# EAGLE design motorthing-v2 (EAGLE 7.5.0)
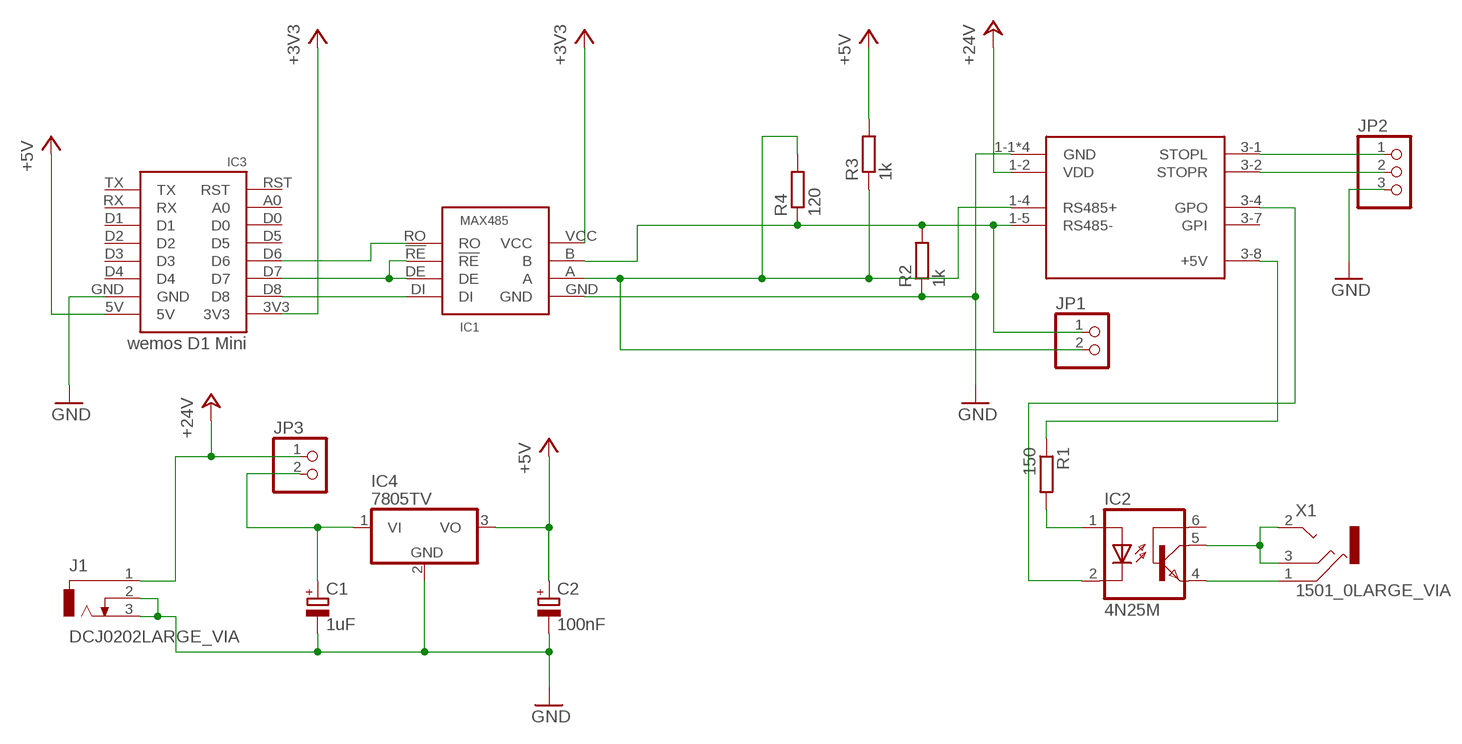
[diagram p0: schematic, sheet 1]

## Parts
C1  1uF  CPOL-EUTT2D6  [TT2D6]
C2  100nF  CPOL-EUTT2D5  [TT2D5]
IC1  MAX485  [DIL08]
IC2  4N25M  [DIL06]
IC3  wemos D1 Mini  WEMOSNOSILK  [WEMOS-NOSILK]
IC4  7805TV  [TO220V]
J1  DCJ0202LARGE_VIA  [DCJ0202_LV]
JP1  PINHD-1X2  [1X02]
JP2  PINHD-1X3  [1X03]
JP3  PINHD-1X2  [1X02]
R1  150  R-EU_0207/10  [0207/10]
R2  1k  R-EU_0207/10  [0207/10]
R3  1k  R-EU_0207/10  [0207/10]
R4  120  R-EU_0207/10  [0207/10]
TMCM-110  TMCM-110  [TMCM-110]
X1  1501_0LARGE_VIA  [1501_05_LV]

## Nets
+3V3: IC1.VCC IC3.3V3
+5V [high_voltage]: C2.+ IC3.5V IC4.3(VO) R3.2
+24V [high_voltage]: J1.1 JP3.1 TMCM-110.1-2(VDD)
GND: C1.- C2.- IC1.GND IC3.GND IC4.2(GND) J1.2 J1.3 JP2.3 R2.1 TMCM-110.1-1(GND) TMCM-110.1-3(GND) TMCM-110.3-3(GND) TMCM-110.3-6(GND)
N$1: IC2.1(A) R1.2
N$2: IC2.4(EMI) X1.1
N$3: IC1.RO IC3.D6
N$4: IC1.DI IC3.D8
N$5: IC1.B JP1.1 R2.2 R4.1 TMCM-110.1-5(RS485-)
N$6: IC2.5(COL) X1.2 X1.3
N$7: R1.1 TMCM-110.3-8(+5V)
N$8: IC2.2(C) TMCM-110.3-4(GPO)
N$9: JP2.1 TMCM-110.3-1(STOPL)
N$10: IC1.!RE IC1.DE IC3.D7
N$11: IC1.A JP1.2 R3.1 R4.2 TMCM-110.1-4(RS485+)
N$12: JP2.2 TMCM-110.3-2(STOPR)
N$13 [high_voltage]: C1.+ IC4.1(VI) JP3.2
Unconnected: IC2.6(BAS) IC3.A0 IC3.D0 IC3.D1 IC3.D2 IC3.D3 IC3.D4 IC3.D5 IC3.RST IC3.RX IC3.TX TMCM-110.3-7(GPI)

## Library data of the parts
C1 C2 = rcl:CPOL-EU: POLARIZED CAPACITOR, European symbol
IC1 = max348x:MAX485
IC2 = optocoupler:4N*?M: General Purpose 6-Pin Phototransistor Optocouplers Source: http://www.fairchildsemi.com/ds/4N/4N35-M.pdf; MPN: 4N25-M; OC_FARNELL: 1021349; OC_NEWARK: 98K9084
IC3 = wemos:WEMOS
IC4 = linear:78*: Positive VOLTAGE REGULATOR Source: http://cache.national.com/ds/LM/LM78L05.pdf http://www.fairchildsemi.com/ds/LM/LM7805.pdf
J1 = myparts:DCJ0202: DC POWER JACK Source: DCJ0202.pdf
JP1 JP3 = pinhead:PINHD-1X2: PIN HEADER
JP2 = pinhead:PINHD-1X3: PIN HEADER
R1-R4 = rcl:R-EU_: RESISTOR, European symbol
TMCM-110 = TMCM:TMCM-110
X1 = myparts:1501_0*: Jack connectors according to JISC 6560, 2.5 mm Klinkensteckverbinder nach JISC 6560, 2,5 mm Source: http://www.lumberg.com/Produkte/PDFs/1501_05.pdfedit 1501_03 http://www.lumberg.com/Produkte/PDFs/1501_06.pdf

## Net classes
0 default: clearance 0.205 mm
1 high_voltage: width 1.016 mm, clearance 0.205 mm to class 0, clearance 0.254 mm

## Board
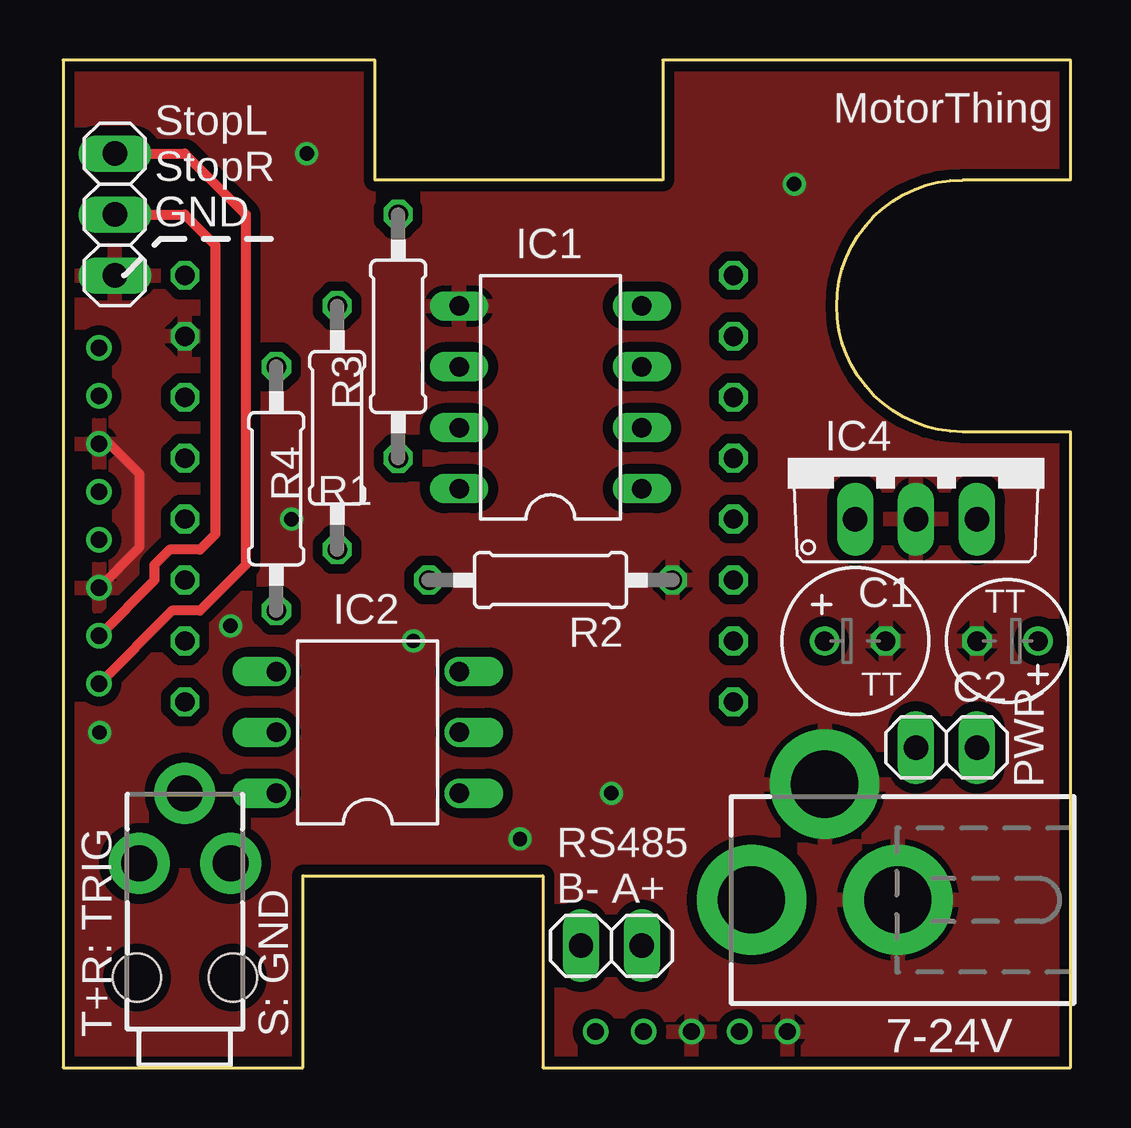
[diagram p1: board, top side]
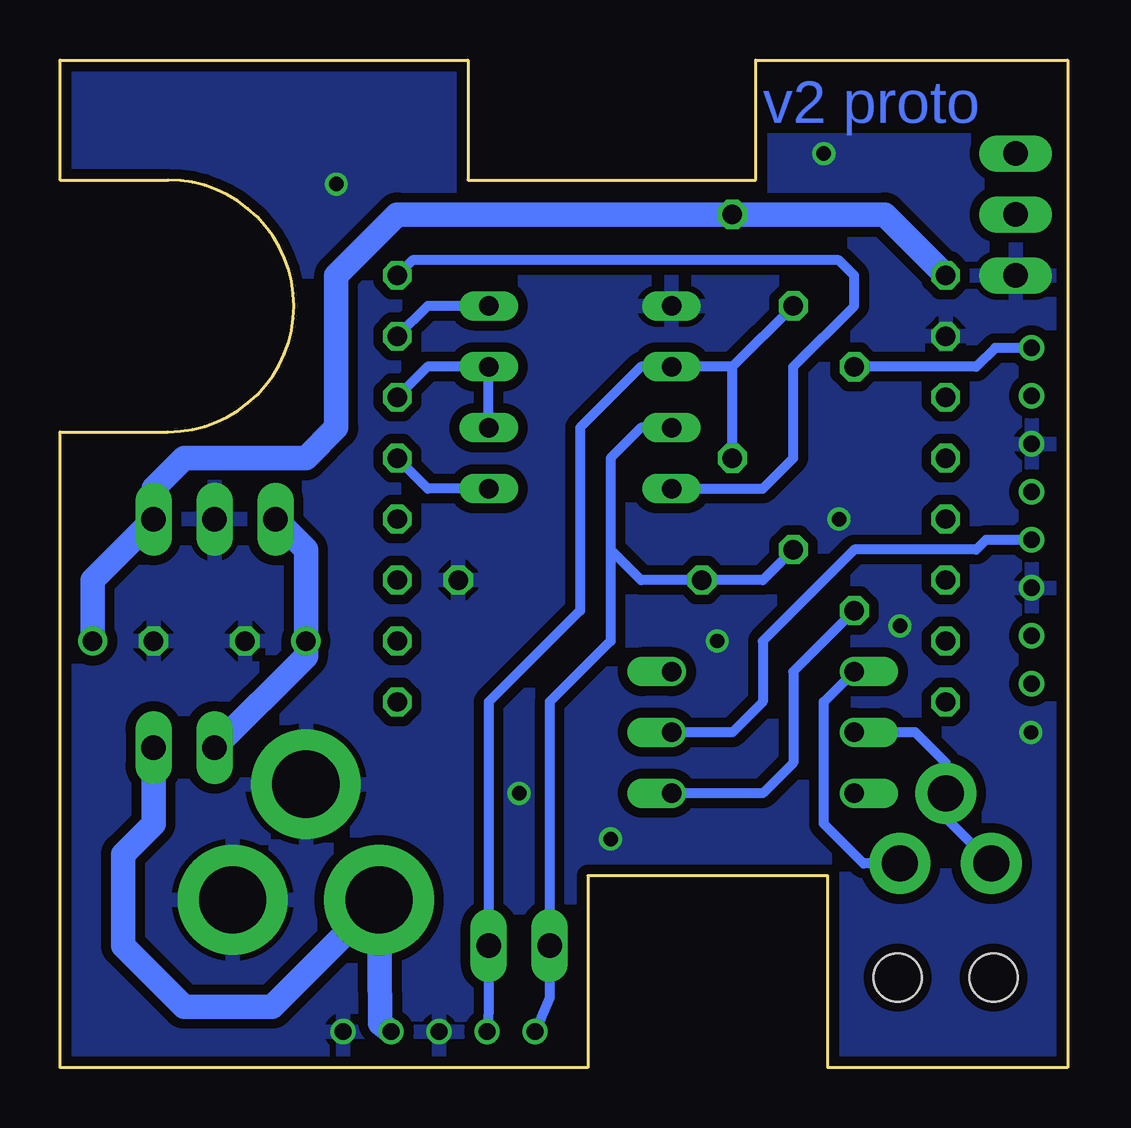
[diagram p2: board, bottom side, seen from below]

Size 42 x 42 mm. Coordinates in mm from the lower left corner, seen from the top.
Copper layers (1*16): Top 0.0356mm / dielectric 1.5011mm / Bottom 0.0356mm
Design rules "LaenPCBOrder": minimum track width 6mil, minimum drill 13mil, track to track 6mil, track to pad 6mil, pad to pad 6mil, via to via 6mil, smd to smd 6mil, copper to edge 15mil, drill to drill 6mil, minimum pad ring 7mil, minimum via ring 7mil, stop-mask expansion 3mil, vias tented up to drill 0mil, thermal gap 10mil

### Footprints (pad centres in the part's own frame; a part is rotated, then mirrored left to right if it is on the bottom)
TT2D6 = drill 0.813: + -1.27,0 | drill 0.813 octagon: - 1.27,0
TT2D5 = drill 0.813: + -1.27,0 | drill 0.813 octagon: - 1.27,0
DIL08 = drill 0.813 long: !RE -1.27,-3.81; A 1.27,3.81; B -1.27,3.81; DE 1.27,-3.81; DI 3.81,-3.81; GND 3.81,3.81; RO -3.81,-3.81; VCC -3.81,3.81
DIL06 = drill 0.813 offset: 1 -2.54,-3.81; 2 0,-3.81; 3 2.54,-3.81; 4 2.54,3.81; 5 0,3.81; 6 -2.54,3.81
WEMOS-NOSILK = drill 0.8 octagon: 3V3 0,0; 5V 22.86,0; A0 0,15.24; D0 0,12.7; D1 22.86,12.7; D2 22.86,10.16; D3 22.86,7.62; D4 22.86,5.08; D5 0,10.16; D6 0,7.62; D7 0,5.08; D8 0,2.54; GND 22.86,2.54; RST 0,17.78; RX 22.86,15.24; TX 22.86,17.78
TO220V = drill 1.016 long: 1 -2.54,-2.54; 2 0,-2.54; 3 2.54,-2.54
DCJ0202_LV = drill 2.8 pad 4.572: 1 0,3.048; 2 4.826,0; 3 0,-3.048
1X02 = drill 1.016 long: 1 -1.27,0; 2 1.27,0
1X03 = drill 1.016 long: 1 -2.54,0; 2 0,0; 3 2.54,0
0207/10 = drill 0.813 octagon: 1 -5.08,0; 2 5.08,0
TMCM-110 = drill 0.7: 1-1 30.2,1.5; 1-2 28.2,1.5; 1-3 26.2,1.5; 1-4 24.2,1.5; 1-5 22.2,1.5; 3-1 1.5,16; 3-2 1.5,18; 3-3 1.5,20; 3-4 1.5,22; 3-5 1.5,24; 3-6 1.5,26; 3-7 1.5,28; 3-8 1.5,30
1501_05_LV = drill 1.5 pad 2.54: 1 -1.905,-8.509; 2 0,-11.43; 3 1.905,-8.509 | hole 2: -2,-3.75; 2,-3.75

### Placement (x,y rotation side)
C1  33.02,17.78 0 top
C2  39.37,17.78 180 top
IC1  20.32,27.94 90 top
IC2  12.7,13.97 90 top
IC3  27.94,33.02 180 top
IC4  35.56,25.4 0 top
J1  31.75,6.99 90 top
JP1  22.86,5.08 0 top
JP2  2.16,35.56 270 top
JP3  36.83,13.34 180 top
R1  8.89,24.13 270 top
R2  20.32,20.32 180 top
R3  13.97,30.48 90 top
R4  11.43,26.67 90 top
TMCM-110  0,0 0 top
X1  5.08,0 180 top

### Tracks (layer width: path | path; a pad name or v marks a point on that pad's centre or on a via)
+3V3
  Bottom 0.406: IC1.VCC 12.7,24.13 11.43,25.4 11.43,29.21 8.89,31.75 8.89,33.02 9.53,33.66 27.3,33.66 IC3.3V3
+5V
  Bottom 1.016: IC3.5V 7.62,35.56 12.7,35.56 R3.2 27.94,35.56 30.48,33.02 30.48,26.67 31.75,25.4 36.83,25.4 38.1,24.13 IC4.3 40.64,20.32 C2.+
+24V
  Bottom 1.016: TMCM-110.1-2 28.65,1.85 J1.1 33.15,2.54 36.83,2.54 39.37,5.08 39.37,8.89 38.1,10.16 JP3.1
GND  (via drill 0.6)
  Top 0.406: TMCM-110.3-6 1.94,26 3.17,24.77 3.17,21.68 TMCM-110.3-3
  other vias: 1.52,13.97 6.99,18.41 19.05,9.53 14.61,17.78 30.48,36.83 10.16,38.1 9.53,22.86 22.86,11.43
  pour Bottom (isolate 0.406): 0,0 41.91,0 41.91,41.91 0,41.91
  pour Top (isolate 0.406): 0,0 41.91,0 41.91,41.91 0,41.91
N$1
  Bottom 0.406: R1.2 11.43,16.51 11.43,12.7 12.7,11.43 IC2.1
N$2
  Bottom 0.406: X1.1 8.51,8.51 10.16,10.16 10.16,15.24 IC2.4
N$3
  Bottom 0.406: IC1.RO 26.67,24.13 IC3.D6
N$4
  Bottom 0.406: IC1.DI 26.67,31.75 IC3.D8
N$5
  Bottom 0.406: TMCM-110.1-5 21.59,2.91 JP1.1 21.59,15.24 19.05,17.78 19.05,21.59 | IC1.B 17.78,26.67 19.05,25.4 19.05,21.59 | 19.05,21.59 17.78,20.32 R2.2 12.7,20.32 R4.1
N$6
  Bottom 0.406: X1.3 5.08,10.4 X1.2 5.08,12.7 6.35,13.97 IC2.5
N$7
  Bottom 0.406: TMCM-110.3-8 3.02,30 3.81,29.21 R1.1
N$8
  Bottom 0.406: TMCM-110.3-4 3.4,22 3.81,21.59 8.89,21.59 12.7,17.78 12.7,15.24 13.97,13.97 IC2.2
N$9
  Top 0.406: JP2.1 5.08,38.1 7.62,35.56 7.62,20.95 5.71,19.05 4.55,19.05 TMCM-110.3-1
N$10
  Bottom 0.406: IC3.D7 26.67,29.21 IC1.DE IC1.!RE
N$11
  Bottom 0.406: TMCM-110.1-4 24.13,2.37 JP1.2 24.13,15.24 20.32,19.05 20.32,26.67 17.78,29.21 IC1.A 13.97,29.21 | R4.2 13.97,29.21 | R3.1 13.97,29.21
N$12
  Top 0.406: JP2.2 5.08,35.56 6.35,34.29 6.35,22.23 5.71,21.59 4.45,21.59 3.81,20.95 3.81,20.31 TMCM-110.3-2
N$13
  Bottom 1.016: IC4.1 31.75,21.59 C1.+ 31.75,17.14 JP3.2

### Text on the board
Bottom: v2 proto
tPlace: MotorThing | StopL / StopR / GND | PWR | RS485 / B- A+ | T+R: TRIG | S: GND | 7-24V